# Altium schematic sheet IO.SchDoc
size A4; SheetNumber: 5; SheetTotal: 10
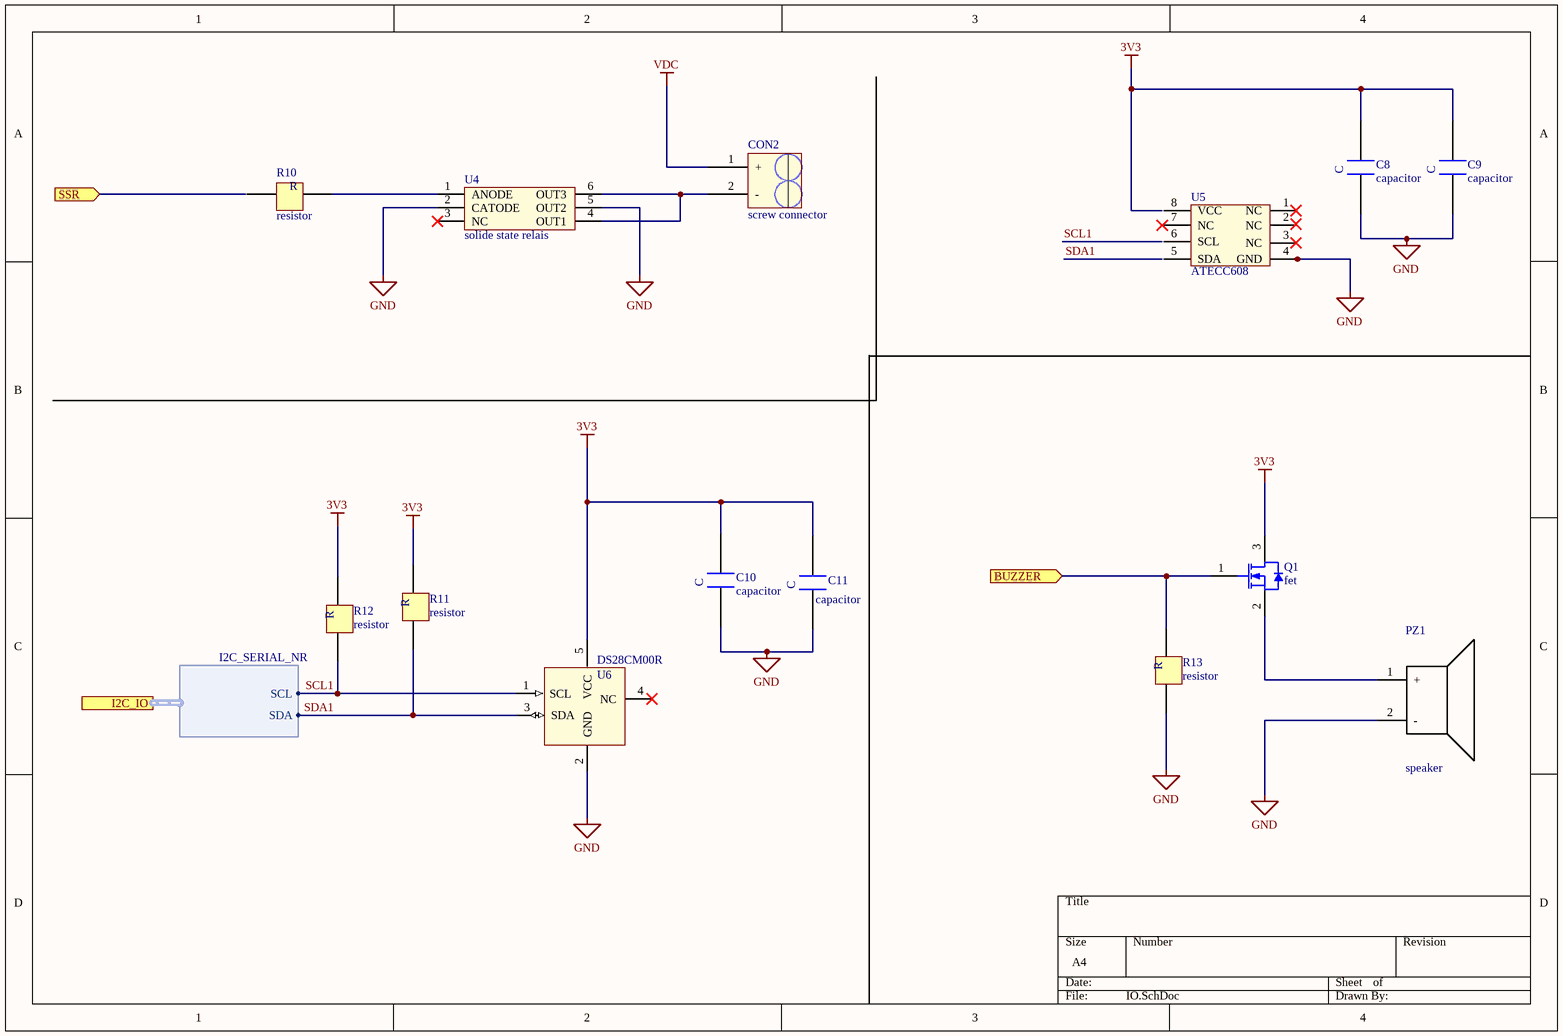
[diagram p0: IO.SchDoc]

## Parts
C8  capacitor  [CAPC1005X04L]
C9  capacitor  [CAPC1005X04L]
C10  capacitor  [CAPC1005X04L]
C11  capacitor  [CAPC1005X04L]
CON2  screw connector  [SCREW connector 5mm pitch]
PZ1  speaker
Q1  fet
R10  resistor  [0603]
R11  resistor  [CAPC1005X04L]
R12  resistor  [CAPC1005X04L]
R13  resistor  [CAPC1005X04L]
U4  solide state relais
U5  ATECC608
U6  DS28CM00R

## Ports
BUZZER (in), I2C_IO (harness I2C_SERIAL_NR), SSR (in)

## Harnesses
I2C_SERIAL_NR: SCL, SDA

## Nets
3V3: C8.1 C9.1 C10.1 C11.1 Q1.3 R11.1 R12.1 U6.5(VCC)
GND: C8.2 C9.2 C10.2 C11.2 PZ1.2(-) R13.2 U4.2(CATODE) U4.5(OUT2) U5.4(GND) U6.2(GND)
VDC: CON2.1(+)
BUZZER: Q1.1 R13.1 ; port BUZZER
SCL1: R12.2 U6.1(SCL) ; port I2C_IO.SCL
SDA1: R11.2 U6.3(SDA) ; port I2C_IO.SDA
NetCON2_2: CON2.2(-) U4.4(OUT1) U4.6(OUT3)
NetPZ1_1: PZ1.1(+) Q1.2
NetR10_1: R10.1 U4.1(ANODE)

Not connected (* = marked no-connect by the designer): R10 2; U4 3(NC)*; U5 1(NC) 2(NC) 3(NC) 5(SDA) 6(SCL) 7(NC) 8(VCC); U6 4(NC)*

## Notes on the sheet
- (in symbol capacitor) C
- (in symbol resistor) R

## Library data of the parts
U4 = G3VM-61HR2(TR05)